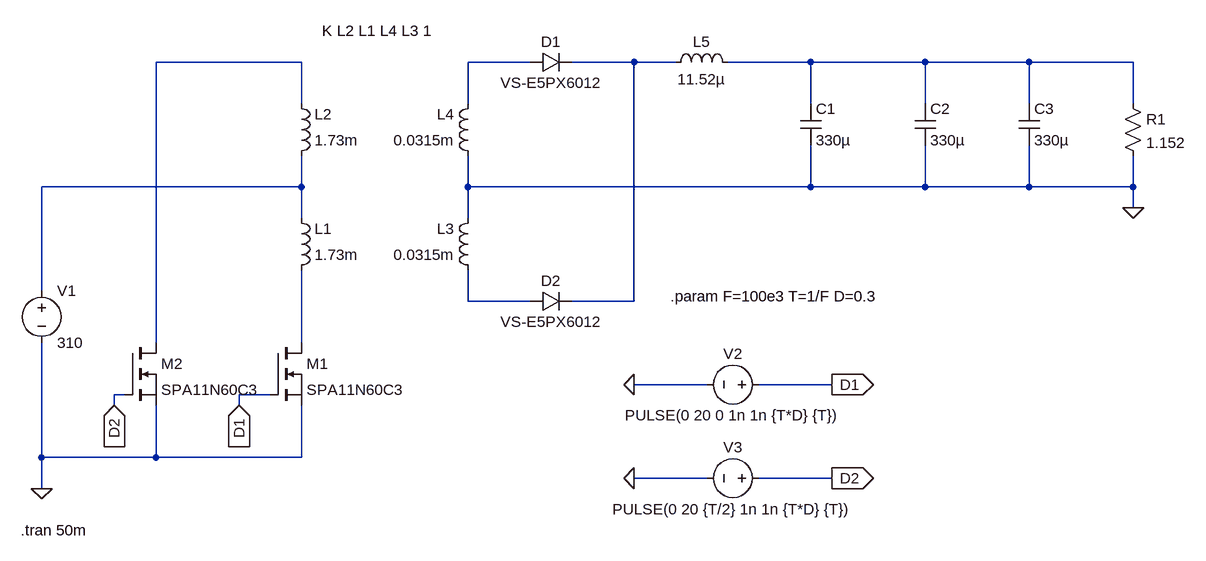
[diagram p0: schematic push_pull_v1.asc]
push_pull_v1.asc, the LTspice schematic file:
Version 4.1
SHEET 1 1648 680
WIRE 272 -64 48 -64
WIRE 624 -64 528 -64
WIRE 784 -64 688 -64
WIRE 848 -64 784 -64
WIRE 1056 -64 928 -64
WIRE 1232 -64 1056 -64
WIRE 1392 -64 1232 -64
WIRE 1552 -64 1392 -64
WIRE 272 0 272 -64
WIRE 528 0 528 -64
WIRE 1056 0 1056 -64
WIRE 1232 0 1232 -64
WIRE 1392 0 1392 -64
WIRE 1552 0 1552 -64
WIRE 272 128 272 80
WIRE 272 128 -128 128
WIRE 528 128 528 80
WIRE 1056 128 1056 64
WIRE 1056 128 528 128
WIRE 1232 128 1232 64
WIRE 1232 128 1056 128
WIRE 1392 128 1392 64
WIRE 1392 128 1232 128
WIRE 1552 128 1552 80
WIRE 1552 128 1392 128
WIRE 1552 160 1552 128
WIRE 272 176 272 128
WIRE 528 176 528 128
WIRE -128 288 -128 128
WIRE 528 304 528 256
WIRE 624 304 528 304
WIRE 784 304 784 -64
WIRE 784 304 688 304
WIRE 48 368 48 -64
WIRE 272 368 272 256
WIRE 896 432 784 432
WIRE 1088 432 976 432
WIRE 0 448 -16 448
WIRE 224 448 176 448
WIRE -16 464 -16 448
WIRE 176 464 176 448
WIRE -128 544 -128 368
WIRE 48 544 48 464
WIRE 48 544 -128 544
WIRE 272 544 272 464
WIRE 272 544 48 544
WIRE 896 576 784 576
WIRE 1088 576 976 576
WIRE -128 592 -128 544
FLAG -128 592 0
FLAG 784 432 0
FLAG 1088 432 D1
IOPIN 1088 432 Out
FLAG 784 576 0
FLAG 1088 576 D2
IOPIN 1088 576 Out
FLAG 176 464 D1
IOPIN 176 464 In
FLAG -16 464 D2
IOPIN -16 464 In
FLAG 1552 160 0
SYMBOL voltage -128 272 R0
WINDOW 123 0 0 Left 0
WINDOW 39 0 0 Left 0
SYMATTR InstName V1
SYMATTR Value 310
SYMBOL ind 256 272 M180
WINDOW 0 36 80 Left 2
WINDOW 3 36 40 Left 2
SYMATTR InstName L1
SYMATTR Value 1.73m
SYMATTR Type ind
SYMBOL ind 256 96 M180
WINDOW 0 36 80 Left 2
WINDOW 3 36 40 Left 2
SYMATTR InstName L2
SYMATTR Value 1.73m
SYMATTR Type ind
SYMBOL ind 544 272 R180
WINDOW 0 36 80 Left 2
WINDOW 3 36 40 Left 2
SYMATTR InstName L3
SYMATTR Value 0.0315m
SYMATTR Type ind
SYMBOL ind 544 96 R180
WINDOW 0 36 80 Left 2
WINDOW 3 36 40 Left 2
SYMATTR InstName L4
SYMATTR Value 0.0315m
SYMATTR Type ind
SYMBOL nmos 224 368 R0
SYMATTR InstName M1
SYMATTR Value SPA11N60C3
SYMBOL nmos 0 368 R0
SYMATTR InstName M2
SYMATTR Value SPA11N60C3
SYMBOL diode 624 -48 R270
WINDOW 0 32 32 VTop 2
WINDOW 3 0 32 VBottom 2
SYMATTR InstName D1
SYMATTR Value VS-E5PX6012
SYMBOL ind 832 -48 R270
WINDOW 0 32 56 VTop 2
WINDOW 3 5 56 VBottom 2
SYMATTR InstName L5
SYMATTR Value 11.52µ
SYMBOL cap 1040 0 R0
SYMATTR InstName C1
SYMATTR Value 330µ
SYMBOL diode 624 320 R270
WINDOW 0 32 32 VTop 2
WINDOW 3 0 32 VBottom 2
SYMATTR InstName D2
SYMATTR Value VS-E5PX6012
SYMBOL voltage 992 432 M270
WINDOW 0 32 56 VTop 2
WINDOW 3 -32 56 VBottom 2
WINDOW 123 0 0 Left 0
WINDOW 39 0 0 Left 0
SYMATTR InstName V2
SYMATTR Value PULSE(0 20 0 1n 1n {T*D} {T})
SYMBOL voltage 992 576 M270
WINDOW 0 32 56 VTop 2
WINDOW 3 -32 56 VBottom 2
WINDOW 123 0 0 Left 0
WINDOW 39 0 0 Left 0
SYMATTR InstName V3
SYMATTR Value PULSE(0 20 {T/2} 1n 1n {T*D} {T})
SYMBOL cap 1216 0 R0
SYMATTR InstName C2
SYMATTR Value 330µ
SYMBOL cap 1376 0 R0
SYMATTR InstName C3
SYMATTR Value 330µ
SYMBOL res 1536 -16 R0
SYMATTR InstName R1
SYMATTR Value 1.152
TEXT 304 -112 Left 2 !K L2 L1 L4 L3 1
TEXT 840 296 Left 2 !.param F=100e3 T=1/F D=0.3
TEXT -160 656 Left 2 !.tran 50m

The netlist it stands for:
* push_pull_v1.asc
V1 N005 0 310
L1 N007 N005 1.73m
L2 N005 N001 1.73m
L3 N006 0 0.0315m
L4 0 N002 0.0315m
M1 N007 D1 0 0 SPA11N60C3
M2 N001 D2 0 0 SPA11N60C3
D1 N002 N003 VS-E5PX6012
L5 N003 N004 11.52µ
C1 N004 0 330µ
D2 N006 N003 VS-E5PX6012
V2 D1 0 PULSE(0 20 0 1n 1n {T*D} {T})
V3 D2 0 PULSE(0 20 {T/2} 1n 1n {T*D} {T})
C2 N004 0 330µ
C3 N004 0 330µ
R1 N004 0 1.152
.model D D
.lib standard.dio
.model NMOS NMOS
.model PMOS PMOS
.lib standard.mos
K L2 L1 L4 L3 1
.param F=100e3 T=1/F D=0.3
.tran 50m
.backanno
.end